# Altium schematic sheet CoproMKII_Actuator.SchDoc: Actuator MCU
size B; Date: MM/DD/YYYY; Author: Sample Author; Organization: ORGANIZATION; Address1: ADDRESS 1; Address2: ADDRESS 2; Address3: ADDRESS 3; Address4: ADDRESS 4; Revision: -; SheetNumber: 3; SheetTotal: 3; ENG_APP_DATE: --/--/--; DSN_APP_DATE: --/--/--; CHK_APP_DATE: --/--/--
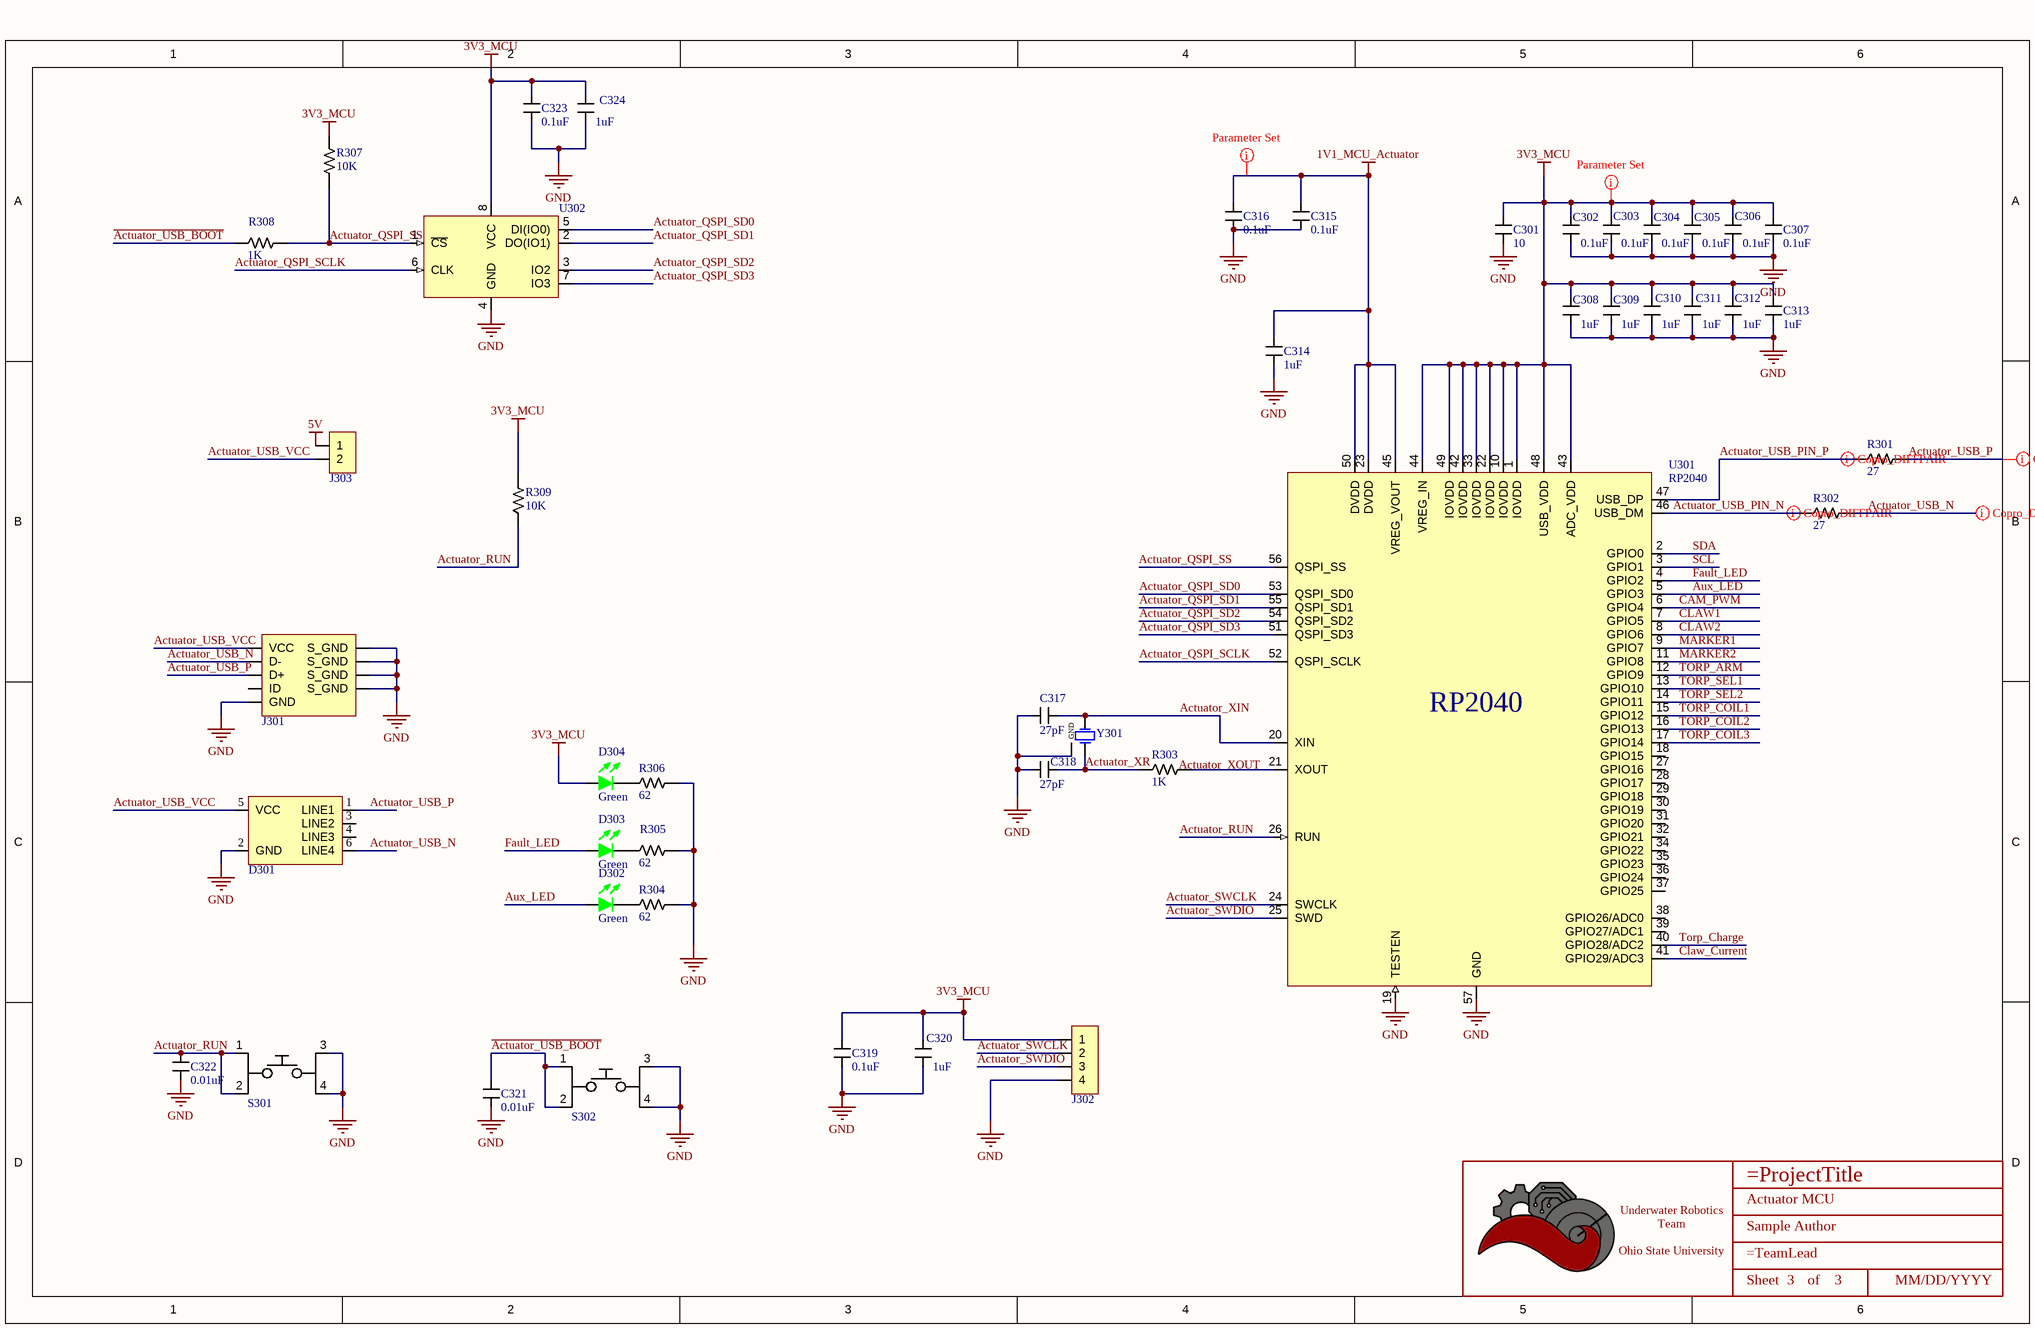
[diagram p0: CoproMKII_Actuator.SchDoc]

## Parts
*  Title_Block  [LOGO]  (value not drawn)  (graphical)
C301  Value (uF): 10  [CAPACITOR_0603]  (hidden comment: 10uF Ceramic 6.3V)
C302  value 0.1uF  [CAPACITOR_0603]  (hidden comment: 100nF Ceramic 6.3V)
C303  value 0.1uF  [CAPACITOR_0603]  (hidden comment: 100nF Ceramic 6.3V)
C304  value 0.1uF  [CAPACITOR_0603]  (hidden comment: 100nF Ceramic 6.3V)
C305  value 0.1uF  [CAPACITOR_0603]  (hidden comment: 100nF Ceramic 6.3V)
C306  value 0.1uF  [CAPACITOR_0603]  (hidden comment: 100nF Ceramic 6.3V)
C307  value 0.1uF  [CAPACITOR_0603]  (hidden comment: 100nF Ceramic 6.3V)
C308  value 1uF  [CAPACITOR_0603]  (hidden comment: 1uF Ceramic 16V)
C309  value 1uF  [CAPACITOR_0603]  (hidden comment: 1uF Ceramic 16V)
C310  value 1uF  [CAPACITOR_0603]  (hidden comment: 1uF Ceramic 16V)
C311  value 1uF  [CAPACITOR_0603]  (hidden comment: 1uF Ceramic 16V)
C312  value 1uF  [CAPACITOR_0603]  (hidden comment: 1uF Ceramic 16V)
C313  value 1uF  [CAPACITOR_0603]  (hidden comment: 1uF Ceramic 16V)
C314  value 1uF  [CAPACITOR_0603]  (hidden comment: 1uF Ceramic 16V)
C315  value 0.1uF  [CAPACITOR_0603]  (hidden comment: 100nF Ceramic 6.3V)
C316  value 0.1uF  [CAPACITOR_0603]  (hidden comment: 100nF Ceramic 6.3V)
C317  value 27pF  [CAPACITOR_0603]  (hidden comment: 27pF Ceramic 50V)
C318  value 27pF  [CAPACITOR_0603]  (hidden comment: 27pF Ceramic 50V)
C319  value 0.1uF  [CAPACITOR_0603]  (hidden comment: 100nF Ceramic 6.3V)
C320  value 1uF  [CAPACITOR_0603]  (hidden comment: 1uF Ceramic 16V)
C321  value 0.01uF  [CAPACITOR_0603]  (hidden comment: 10nF Ceramic 6.3V)
C322  value 0.01uF  [CAPACITOR_0603]  (hidden comment: 10nF Ceramic 6.3V)
C323  value 0.1uF  [CAPACITOR_0603]  (hidden comment: 100nF Ceramic 6.3V)
C324  value 1uF  [CAPACITOR_0603]  (hidden comment: 1uF Ceramic 16V)
D301  TVS DIODE 5VWM 25VC SOT23-6  [SOT 23-6L]  (value not drawn)
D302  Color: Green  [LED_0603]  (hidden comment: IN-S63AT5G)
D303  Color: Green  [LED_0603]  (hidden comment: IN-S63AT5G)
D304  Color: Green  [LED_0603]  (hidden comment: IN-S63AT5G)
J301  USB_MICRO R/A  [CONN_MINIUSB]  (value not drawn)
J302  CONN HEADER VERT 4POS 2.54MM  [HEADER_4PIN_2.54MM]  (value not drawn)
J303  2 POS  [HEADER_2PIN_2.54MM]  (value not drawn)
R301  Value  (Ohms): 27  [RESISTOR_0603]  (hidden comment: 27 Ohm 5% 1/8W)
R302  Value  (Ohms): 27  [RESISTOR_0603]  (hidden comment: 27 Ohm 5% 1/8W)
R303  Value  (Ohms): 1K  [RESISTOR_0603]  (hidden comment: 1k Ohm 5% 1/8W)
R304  Value  (Ohms): 62  [RESISTOR_0603]  (hidden comment: 62 Ohm 1% 1/4W)
R305  Value  (Ohms): 62  [RESISTOR_0603]  (hidden comment: 62 Ohm 1% 1/4W)
R306  Value  (Ohms): 62  [RESISTOR_0603]  (hidden comment: 62 Ohm 1% 1/4W)
R307  Value  (Ohms): 10K  [RESISTOR_0603]  (hidden comment: 10k Ohm 5% 1/10W)
R308  Value  (Ohms): 1K  [RESISTOR_0603]  (hidden comment: 1k Ohm 5% 1/8W)
R309  Value  (Ohms): 10K  [RESISTOR_0603]  (hidden comment: 10k Ohm 5% 1/10W)
S301  SPST Tactile Switch  [TactileSwitch]  (value not drawn)
S302  SPST Tactile Switch  [TactileSwitch]  (value not drawn)
U301  RP2040  [QFN-56 RP2040]
U302  W25Q128JVSIQ  [SOIC-8 W25QxJV]  (value not drawn)
Y301  CRYSTAL 12.0000MHZ 18PF SMD  [4-SMD No Lead Crystal]  (value not drawn)

## Nets
1V1_MCU_Actuator: C314.2 C315.2 C316.2 U301.23(DVDD) U301.45(VREG_VOUT) U301.50(DVDD)
3V3_MCU: C301.2 C302.2 C303.2 C304.2 C305.2 C306.2 C307.2 C308.2 C309.2 C310.2 C311.2 C312.2 C313.2 C319.1 C320.1 C323.1 C324.1 D304.1 J302.1 R307.2 R309.1 U301.1(IOVDD) U301.10(IOVDD) U301.22(IOVDD) U301.33(IOVDD) U301.42(IOVDD) U301.43(ADC_VDD) U301.44(VREG_IN) U301.48(USB_VDD) U301.49(IOVDD) U302.8(VCC)
5V: J303.1
GND: C301.1 C302.1 C303.1 C304.1 C305.1 C306.1 C307.1 C308.1 C309.1 C310.1 C311.1 C312.1 C313.1 C314.1 C315.1 C316.1 C317.2 C318.2 C319.2 C320.2 C321.2 C322.2 C323.2 C324.2 D301.2(GND) J301.5(GND) J301.6(S_GND) J301.7(S_GND) J301.8(S_GND) J301.9(S_GND) J302.4 R304.1 R305.1 R306.1 S301.3 S301.4 S302.3 S302.4 U301.19(TESTEN) U301.57(GND) U302.4(GND) Y301.GND
~{Actuator_USB_BOOT}: C321.1 R308.2 S302.1 S302.2
Actuator_QSPI_SCLK: U301.52(QSPI_SCLK) U302.6(CLK)
Actuator_QSPI_SD0: U301.53(QSPI_SD0) U302.5(DI(IO0))
Actuator_QSPI_SD1: U301.55(QSPI_SD1) U302.2(DO(IO1))
Actuator_QSPI_SD2: U301.54(QSPI_SD2) U302.3(IO2)
Actuator_QSPI_SD3: U301.51(QSPI_SD3) U302.7(IO3)
Actuator_QSPI_SS: R307.1 R308.1 U301.56(QSPI_SS) U302.1(~{CS})
Actuator_RUN: C322.1 R309.2 S301.1 S301.2 U301.26(RUN)
Actuator_SWCLK: J302.2 U301.24(SWCLK)
Actuator_SWDIO: J302.3 U301.25(SWD)
Actuator_USB_N: D301.6(LINE4) J301.2(D-) R302.1
Actuator_USB_P: D301.1(LINE1) J301.3(D+) R301.1
Actuator_USB_PIN_N: R302.2 U301.46(USB_DM)
Actuator_USB_PIN_P: R301.2 U301.47(USB_DP)
Actuator_USB_VCC: D301.5(VCC) J301.1(VCC) J303.2
Actuator_XIN: C317.1 U301.20(XIN) Y301.1
Actuator_XR: C318.1 R303.2 Y301.2
Aux_LED: D302.1 U301.5(GPIO3)
CAM_PWM: U301.6(GPIO4)
CLAW1: U301.7(GPIO5)
CLAW2: U301.8(GPIO6)
Claw_Current: U301.41(GPIO29/ADC3)
Fault_LED: D303.1 U301.4(GPIO2)
MARKER1: U301.9(GPIO7)
MARKER2: U301.11(GPIO8)
SCL: U301.3(GPIO1)
SDA: U301.2(GPIO0)
TORP_ARM: U301.12(GPIO9)
Torp_Charge: U301.40(GPIO28/ADC2)
TORP_COIL1: U301.15(GPIO12)
TORP_COIL2: U301.16(GPIO13)
TORP_COIL3: U301.17(GPIO14)
TORP_SEL1: U301.13(GPIO10)
TORP_SEL2: U301.14(GPIO11)
NetD302_2: D302.2 R304.2
NetD303_2: D303.2 R305.2
NetD304_2: D304.2 R306.2
NetR303_1: R303.1 U301.21(XOUT)

Not connected (* = marked no-connect by the designer): D301 3(LINE2) 4(LINE3); J301 4(ID); U301 18(GPIO15) 27(GPIO16) 28(GPIO17) 29(GPIO18) 30(GPIO19) 31(GPIO20) 32(GPIO21) 34(GPIO22) 35(GPIO23) 36(GPIO24) 37(GPIO25) 38(GPIO26/ADC0) 39(GPIO27/ADC1)

## Layout directives
rule Supply Nets [Voltage = 3.300]: 3V3_MCU
rule Supply Nets [Voltage = 1.100]: 1V1_MCU_Actuator
differential pair; differential pair class USB 2.0: Actuator_USB_N, Actuator_USB_P, Actuator_USB_PIN_N, Actuator_USB_PIN_P

## Notes on the sheet
- Labels drawn without touching a wire or pin: Actuator_XOUT
- DWG. NO.
- REV.
- SHT.
- THIS DOCUMENT AND THE DATA DISCLOSED HEREIN OR HEREWITH IS THE PROPERTY OF ALTIUM LIMITED AND MAY BE FREELY DISTRIBUTED IN WHOLE. NO RIGHTS ARE RESERVED OR EXPRESS OR IMPLIED WARANTEE GIVEN.
- REVISION
- DESCRIPTION
- DATE
- APPROVED
- ENG:
- APPROVALS
- PROJECT
- DSN:
- CHK:
- REFERENCE DOCUMENTS
- PROJECT REVISION:
- TITLE
- DOCUMENT REVISION:
- DESIGN ITEM:
- BOM:
- FAB DWG:
- PCB DWG:
- ASSY DWG:
- SCALE:
- SIZE
- B
- CAGE CODE
- FILE NAME
- DWG NO.
- SHEET
- OF
- REV
- (in symbol Title_Block) Underwater Robotics Team / Ohio State University; Sheet; of

## Library data of the parts
* = Title_Block: UWRT Schematic Title Block Template / Created June 2021, Dylan Trainor
C301 = CAPACITOR_10uF_0603: Cap 10uF 6.3V +/-20% / Ceramic 0603; Made By: Flip B; ComponentLink1Description: Digikey; ComponentLink1URL: https://www.digikey.com/en/products/detail/samsung-electro-mechanics/CL10A106MQ8NNNC/3886777; Supplier 1: Digi-Key; Supplier Part Number 1: 1276-1119-1-ND; Tolerance: +/- 20%; Voltage: 6.3V
C302-C307 C315 C316 C319 C323 = CAPACITOR_0.1uF_0603: Cap 100nF 6.3V +/-10% / Ceramic 0603; Made By: Flip B; ComponentLink1Description: Datsheet; ComponentLink1URL: https://www.mouser.com/datasheet/2/212/KEM_C1002_X7R_SMD-1102033.pdf; Tolerance: +/- 10%; Voltage: 6.3V; Supplier 1: Digi-Key; Supplier Part Number 1: 399-15351-1-ND
C308-C314 C320 C324 = CAPACITOR_1uF_0603: Cap 1uF 16V +/-10% / Ceramic 0603; Made By: Flip B; Tolerance: +/- 10%; Voltage: 16V; Supplier 1: Digi-Key; Supplier Part Number 1: 399-7847-1-ND
C317 C318 = CAPACITOR_0.000027uF_0603: Cap 27pF 50V +/-5% / Ceramic 0603; Made By: Flip B; ComponentLink1Description: Datsheet; ComponentLink1URL: https://www.mouser.com/datasheet/2/212/KEM_C1002_X7R_SMD-1102033.pdf; Tolerance: +/- 5%; Voltage: 50V; Supplier 1: Digi-Key; Supplier Part Number 1: 311-1063-1-ND
C321 C322 = CAPACITOR_0.01uF_0603: Cap 10nF 6.3V +/-20% / Ceramic 0603; Tolerance: +/- 10%; Made By: Flip B; ComponentLink1Description: Datsheet; ComponentLink1URL: https://www.mouser.com/datasheet/2/212/KEM_C1002_X7R_SMD-1102033.pdf; Voltage: 6.3V; Supplier 1: Mouser; Supplier Part Number 1: 80-C0603C103K9R
D301 = RCLAMP0504S.TCT: 25V Clamp 6A (8/20µs) Ipp Tvs Diode Surface Mount SOT-23-6; Made By: Robert Pafford; Reverse Standoff Voltage (Typ): 5V; Breakdown Voltage (Min): 6V; Supplier 1: Digi-Key; Supplier Part Number 1: RCLAMP0504SCT-ND; Clamping Voltage (Max): 25V
D302-D304 = LED_Green_0603_3V: LED Green Vf= 3V If = 0.005A / IN-S63AT5G; Made By: Robert Pafford; Forward Current: 5mA; ComponentLink1Description: Datasheet; ComponentLink1URL: https://www.we-online.de/katalog/datasheet/150060GS75000.pdf; Forward Voltage: 3V; Package: 0603; Supplier 1: Digi-Key; Supplier Part Number 1: 1830-1062-1-ND
J301 = CONN_MICROUSB: Amphenol Micro USB-B / USB2.0 5 Pin Right Angle SMD; Pitch: 0.65mm; Current Per Pin: 1.8A; Number of Positions: 5; Manufacturer: Amphenol; Configuration: Right Angle; Color: Silver; Created By: Flip B; ComponentLink1Description: Datasheet; ComponentLink1URL: https://cdn.amphenol-icc.com/media/wysiwyg/files/documentation/datasheet/inputoutput/io_usb_micro.pdf?__cf_chl_jschl_tk__=05693735e19256298f6ef6ca2bb2e65c376a4f56-1625503833-0-Abitsb0-ufjOXJYs_S3J3r2iTn-nObalbmXUksF1VvO_h_WEmRdMlUD1I8-hmWSEVWzY1pirKnrPZWfgY3851qyBZe5ZvnNQePLGIzUgdEIQBVUyW36RsbYpDLEWxJ4horD-5gChFgobLYqwmG5aHl0E8lIn_twwPPrOxilK2gP0q9t_CNOs_u5fMqXvXUrlsOv8tIE2NRlu6NVP8qtkL2GjhlkeTUbDMF8WvvpPDTFOgvZ4Y16Ej8F8AhWos88mo5B1HssXozw0XrkJQIqERITUu6rqloz9kf4ZzhBHtDAt-IkiAFY_Ds9SW8FYKKTtINJVpHZQ6Gyu1FFM4Dc9MO0maE8_mmNcwlxqyRoRk_MPWW8VyByXWM5RSp52jteRKw7FeI9WIYvCbPAOy0Eyib-aseIQsnGbglBcUY6_2xp8GYaJM38H3dNvBPsSOfJBPndKedwKHllxjkucXn6xsN0sDXkpGN-cu8_2bDTJ0g-uUucKSCooYX-ApSDNGpkA_p9zv1SOAD8c0zaZVmtiBsN75QpVz2rzq9_BFxOywPvR; Series: 10118192; Supplier 1: Digi-Key; Supplier Part Number 1: 609-4613-1-ND
J302 = HEADER_4PIN_2.54MM: Made By: Robert Pafford; Supplier 1: Digi-Key; Supplier Part Number 1: S1012E-04-ND
J303 = HEADER_2PIN_2.54MM: CONN HEADER VERT 2POS 2.54MM; Configuration: Vertical; Current Per Pin: 1A; Number of Positions: 2; Manufacturer: *; Pitch: 2.54mm; Color: Natural; Created By: Robert P; ComponentLink1Description: Datasheet; ComponentLink1URL: https://www.molex.com/pdm_docs/sd/026013115_sd.pdf; Series: *; Supplier 1: Digi-Key; Supplier Part Number 1: A121480-ND; Supplier 2: Mouser; Supplier Part Number 2: 571-5-146280-2
R301 R302 = RESISTOR_27_0603: RES 27 OHM 5% 1/8W 0603; Tolerance: +/- 5%; Made By: Robert Pafford; ComponentLink1Description: Datasheet; ComponentLink1URL: https://www.bourns.com/docs/product-datasheets/CRxxxxx.pdf; Wattage: 1/8W; Supplier: Digikey; Digikey Part Numer: CR0603-JW-104ELFTR-ND; Supplier 1: Digi-Key; Supplier Part Number 1: 2019-RK73B1JTTD270JCT-ND
R303 R308 = RESISTOR_1K_0603: RES 1k OHM 5% 1/8W 0603; Tolerance: +/- 5%; Made By: Robert Pafford; ComponentLink1Description: Datasheet; ComponentLink1URL: https://www.bourns.com/docs/product-datasheets/CRxxxxx.pdf; Wattage: 1/8W; Supplier: Digikey; Digikey Part Numer: CR0603-JW-104ELFTR-ND; Supplier 1: Digi-Key; Supplier Part Number 1: 2019-RK73B1JTTD102JCT-ND
R304-R306 = RESISTOR_62_0603: RES SMD 62 OHM 1% 1/4W 0603; Tolerance: +/- 1%; Made By: Robert Pafford; ComponentLink1Description: Datasheet; ComponentLink1URL: https://www.bourns.com/docs/product-datasheets/CRxxxxx.pdf; Wattage: 1/4W; Supplier: Digikey; Digikey Part Numer: CR0603-JW-104ELFTR-ND; Supplier 1: Digi-Key; Supplier Part Number 1: 541-RCS060362R0FKEACT-ND
R307 R309 = RESISTOR_10K_0603: RES 10k OHM 5% 1/10W 0603; Tolerance: +/- 5%; Wattage: 1/8W; Made By: Robert Pafford; ComponentLink1Description: Datasheet; ComponentLink1URL: https://www.bourns.com/docs/product-datasheets/CRxxxxx.pdf; Supplier: Digikey; Digikey Part Numer: CR0603-JW-104ELFTR-ND; Supplier 1: Digi-Key; Supplier Part Number 1: 2019-RK73B1JTTD103JCT-ND
S301 S302 = Tactile Switch: SWITCH TACTILE SPST-NO 0.05A 12V; Made By: Robert Pafford; Supplier 1: Digi-Key; Supplier Part Number 1: EG2494-ND
U301 = RP2040: Raspberry Pi RP2040; Made By: Robert Pafford; Input Voltage: 3.3V; Crystal Frequency: 12 MHz; Number of GPIOs: 29; Available Busses: SPI, I2C, PWM, USB; ComponentLink1Description: DigiKey; ComponentLink1URL: *; ComponentLink2Description: Datasheet; ComponentLink2URL: https://datasheets.raspberrypi.org/rp2040/rp2040-datasheet.pdf
U302 = W25Q128JVSIQ: IC FLASH 128MBIT SPI/QUAD 8SOIC; Made By: Robert Pafford; Supplier 1: Digi-Key; Supplier Part Number 1: W25Q128JVSIQ-ND; Size: 128M
Y301 = CRYSTAL_12MHz_SMD: 12 MHz ±20ppm Crystal 18pF 50 Ohms 4-SMD, No Lead; pin to pad: 2>3 GND>2+4; Made By: Siddharth Venkatesan; Frequency: 25 MHz; ESR: 40 Ohms; Load Capacitance: 18pF; Supplier 1: Digi-Key; Supplier Part Number 1: XC2312CT-ND